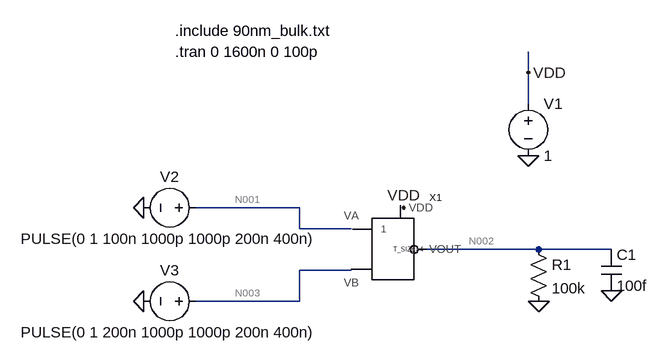
[diagram p0: schematic Draft8.asc]
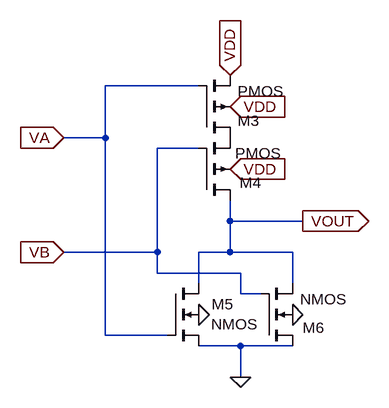
[diagram p1: sub-circuit nor.asc]
Draft8.asc, the LTspice schematic file:
Version 4
SHEET 1 912 680
WIRE 720 -144 720 -176
WIRE 720 -96 720 -144
WIRE 368 64 208 64
WIRE 368 96 368 64
WIRE 448 96 368 96
WIRE 736 128 560 128
WIRE 848 128 736 128
WIRE 448 160 368 160
WIRE 368 208 368 160
WIRE 368 208 208 208
FLAG 128 64 0
FLAG 128 208 0
FLAG 528 64 VDD
FLAG 848 192 0
FLAG 720 -16 0
FLAG 720 -144 VDD
FLAG 736 208 0
SYMBOL voltage 224 64 R90
WINDOW 0 -32 56 VBottom 2
WINDOW 3 32 56 VTop 2
WINDOW 123 0 0 Left 0
WINDOW 39 0 0 Left 0
SYMATTR InstName V2
SYMATTR Value PULSE(0 1 100n 1000p 1000p 200n 400n)
SYMBOL nor 512 128 R0
WINDOW 39 0 0 Left 0
SYMATTR InstName X1
SYMATTR SpiceLine T_SIZE=4
SYMBOL voltage 224 208 R90
WINDOW 0 -32 56 VBottom 2
WINDOW 3 32 56 VTop 2
WINDOW 123 0 0 Left 0
WINDOW 39 0 0 Left 0
SYMATTR InstName V3
SYMATTR Value PULSE(0 1 200n 1000p 1000p 200n 400n)
SYMBOL cap 832 128 R0
SYMATTR InstName C1
SYMATTR Value 100f
SYMBOL voltage 720 -112 R0
WINDOW 123 0 0 Left 0
WINDOW 39 0 0 Left 0
SYMATTR InstName V1
SYMATTR Value 1
SYMBOL res 720 112 R0
SYMATTR InstName R1
SYMATTR Value 100k
TEXT 176 -176 Left 2 !.tran 0 1600n 0 100p
TEXT 176 -208 Left 2 !.include 90nm_bulk.txt

nor.asc, the sub-circuit schematic file:
Version 4
SHEET 1 880 680
WIRE -656 -16 -800 -16
WIRE -800 64 -800 -16
WIRE -800 64 -864 64
WIRE -656 80 -720 80
WIRE -608 192 -608 160
WIRE -496 192 -608 192
WIRE -720 240 -720 80
WIRE -720 240 -864 240
WIRE -608 240 -608 192
WIRE -608 240 -656 240
WIRE -512 240 -608 240
WIRE -720 272 -720 240
WIRE -592 272 -720 272
WIRE -656 288 -656 240
WIRE -512 288 -512 240
WIRE -592 304 -592 272
WIRE -560 304 -592 304
WIRE -800 368 -800 64
WIRE -704 368 -800 368
WIRE -592 384 -656 384
WIRE -512 384 -592 384
WIRE -592 432 -592 384
FLAG -592 432 0
FLAG -608 -32 VDD
IOPIN -608 -32 In
FLAG -656 336 0
FLAG -512 336 0
FLAG -864 64 VA
IOPIN -864 64 In
FLAG -864 240 VB
IOPIN -864 240 In
FLAG -496 192 VOUT
IOPIN -496 192 Out
FLAG -608 16 VDD
IOPIN -608 16 In
FLAG -608 112 VDD
IOPIN -608 112 In
SYMBOL pmos4 -656 64 M180
WINDOW 0 60 26 Left 2
WINDOW 3 60 72 Left 2
SYMATTR InstName M3
SYMBOL pmos4 -656 160 M180
WINDOW 0 63 27 Left 2
SYMATTR InstName M4
SYMBOL nmos4 -704 288 R0
WINDOW 0 68 32 Left 2
WINDOW 3 67 63 Left 2
SYMATTR InstName M5
SYMBOL nmos4 -560 384 M180
WINDOW 0 64 28 Left 2
WINDOW 3 60 72 Left 2
SYMATTR InstName M6

The netlist it stands for:
* Draft8.asc
V2 N001 0 PULSE(0 1 100n 1000p 1000p 200n 400n)
XX1 N001 N003 VDD N002 nor params: T_SIZE=4
V3 N003 0 PULSE(0 1 200n 1000p 1000p 200n 400n)
C1 N002 0 100f
V1 VDD 0 1
R1 N002 0 100k

* block symbol definitions
.subckt nor VA VB VDD VOUT
M3 P001 VA VDD VDD PMOS
M4 VOUT VB P001 VDD PMOS
M5 VOUT VA 0 0 NMOS
M6 0 VB VOUT 0 NMOS
.ends nor

.model NMOS NMOS
.model PMOS PMOS
.lib standard.mos
.tran 0 1600n 0 100p
.include 90nm_bulk.txt
.backanno
.end

* Results of the author's LTspice run, read from the files saved beside the schematic
* Operating Point, zero values left out:
*   V(vdd) = 1 V
*   V(n002) = 562.8 mV
*   I(R1) = 5.628 µA
*   I(V1) = -5.629 µA
*   I(V3) = 177.2 pA
*   I(V2) = 240.6 pA
*   Ix(x1:VA) = -240.6 pA
*   Ix(x1:VB) = -177.2 pA
*   Ix(x1:VDD) = 5.629 µA
*   Ix(x1:VOUT) = -5.628 µA
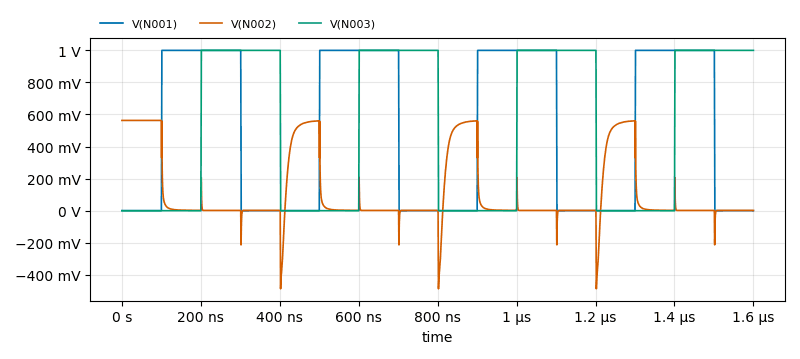
[diagram p2: Transient Analysis of Draft8.asc, plotted from the saved traces]
* Transient Analysis, 1 run:
*   V(N001): min 0 V, max 1 V, average 502.5 mV, rms 708.3 mV, last 0 V
*   V(N002): min -487.4 mV, max 562.8 mV, average 114.2 mV, rms 252.4 mV, last 1.541 mV
*   V(N003): min 0 V, max 1 V, average 501.6 mV, rms 707.7 mV, last 1 V